# EAGLE design lome6 (EAGLE 5.11)
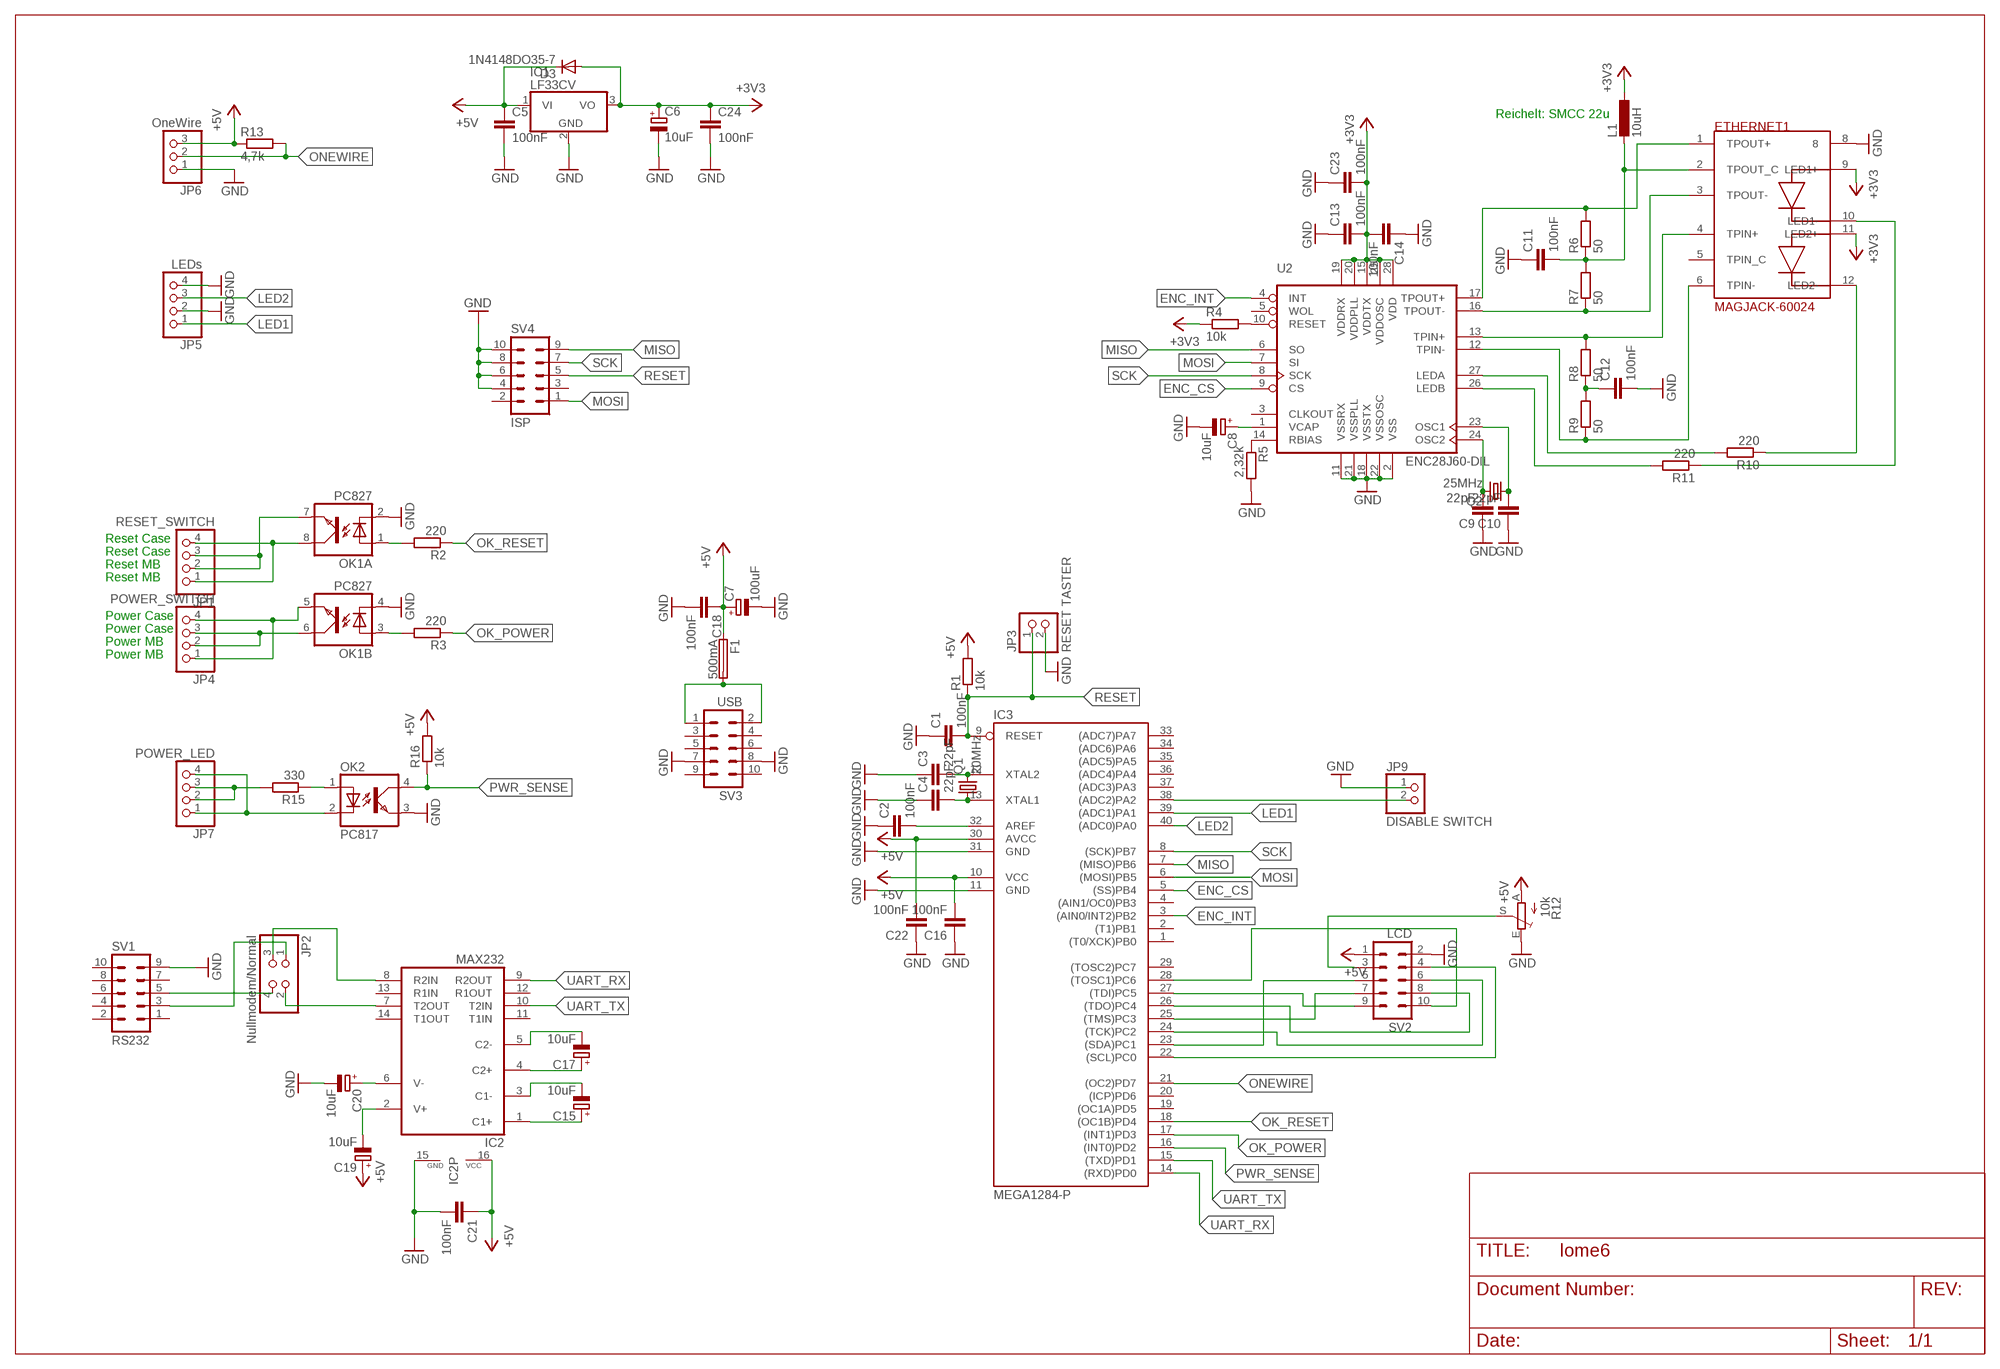
[diagram p0: schematic, sheet 1]

## Parts
C1  100nF  C-EU025-030X050  [C025-030X050]
C2  100nF  C-EU025-030X050  [C025-030X050]
C3  22pF  C-EU025-030X050  [C025-030X050]
C4  22pF  C-EU025-030X050  [C025-030X050]
C5  100nF  C-EU025-030X050  [C025-030X050]
C6  10uF  CPOL-EUE5-6  [E5-6]
C7  100uF  CPOL-EUE5-6  [E5-6]
C8  10uF  CPOL-EUE5-6  [E5-6]
C9  22pF  C-EU025-030X050  [C025-030X050]
C10  22pF  C-EU025-030X050  [C025-030X050]
C11  100nF  C-EU025-030X050  [C025-030X050]
C12  100nF  C-EU025-030X050  [C025-030X050]
C13  100nF  C-EU025-030X050  [C025-030X050]
C14  100nF  C-EU025-030X050  [C025-030X050]
C15  10uF  CPOL-EUE5-6  [E5-6]
C16  100nF  C-EU025-030X050  [C025-030X050]
C17  10uF  CPOL-EUE5-6  [E5-6]
C18  100nF  C-EU025-030X050  [C025-030X050]
C19  10uF  CPOL-EUE5-6  [E5-6]
C20  10uF  CPOL-EUE5-6  [E5-6]
C21  100nF  C-EU025-030X050  [C025-030X050]
C22  100nF  C-EU025-030X050  [C025-030X050]
C23  100nF  C-EU025-030X050  [C025-030X050]
C24  100nF  C-EU025-030X050  [C025-030X050]
D3  1N4148DO35-7  [DO35-7]
ETHERNET1  MAGJACK_60024  [MAGJACK]
F1  500mA  PICOFUSE  [PICOFUSE]
IC1  LF33CV  7805TV  [TO220V]
IC2  MAX232  [DIL16]
IC3  MEGA1284-P  MEGA32-P  [DIL40]
JP1  RESET_SWITCH  PINHD-1X4/90  [1X04/90]
JP2  Nullmodem/Normal  PINHD-2X2  [2X02]
JP3  RESET TASTER  PINHD-1X2  [1X02]
JP4  POWER_SWITCH  PINHD-1X4/90  [1X04/90]
JP5  LEDs  PINHD-1X4  [1X04]
JP6  OneWire  PINHD-1X3  [1X03]
JP7  POWER_LED  PINHD-1X4  [1X04]
JP9  DISABLE SWITCH  PINHD-1X2  [1X02]
L1  10uH  L-EU0207/7  [0207/7]
OK1  PC827  [DIL08]
OK2  PC817  [DIL04]
Q1  20MHz  CRYSTALHC49S  [HC49/S]
Q2  25MHz  CRYSTALHC49S  [HC49/S]
R1  10k  R-EU_0204/5  [0204/5]
R2  220  R-EU_0204/5  [0204/5]
R3  220  R-EU_0204/5  [0204/5]
R4  10k  R-EU_0204/5  [0204/5]
R5  2,32k  R-EU_0204/5  [0204/5]
R6  50  R-EU_0204/2V  [0204V]
R7  50  R-EU_0204/5  [0204/5]
R8  50  R-EU_0204/2V  [0204V]
R9  50  R-EU_0204/5  [0204/5]
R10  220  R-EU_0204/2V  [0204V]
R11  220  R-EU_0204/2V  [0204V]
R12  10k  TRIM_EU-PT10  [PT-10]
R13  4,7k  R-EU_0204/2V  [0204V]
R15  330  R-EU_0204/5  [0204/5]
R16  10k  R-EU_0204/5  [0204/5]
SV1  RS232  ML10  [ML10]
SV2  LCD  ML10  [ML10]
SV3  USB  ML10  [ML10]
SV4  ISP  ML10  [ML10]
U2  ENC28J60-DIL  [DIL28-3]

## Nets
+3V3: C6.+ C13.2 C14.2 C23.2 C24.1 D3.A ETHERNET1.9(LED1+) ETHERNET1.11(LED2+) IC1.3(VO) L1.1 R4.1 U2.15(VDDTX) U2.19(VDDRX) U2.20(VDDPLL) U2.25(VDDOSC) U2.28(VDD)
+5V: C5.1 C7.+ C16.2 C18.1 C19.+ C21.1 C22.2 D3.C F1.1 IC1.1(VI) IC2.16(VCC) IC3.10(VCC) IC3.30(AVCC) JP6.3 R1.2 R12.A R13.1 R16.2 SV2.1
ENC_CS: IC3.5((SS)PB4) U2.9(CS)
ENC_INT: IC3.3((AIN0/INT2)PB2) U2.4(INT)
GND: C1.1 C2.1 C3.1 C4.1 C5.2 C6.- C7.- C8.- C9.1 C10.1 C11.1 C12.2 C13.1 C14.1 C16.1 C18.2 C20.- C21.2 C22.1 C23.1 C24.2 ETHERNET1.8 IC1.2(GND) IC2.15(GND) IC3.11(GND) IC3.31(GND) JP3.2 JP5.2 JP5.4 JP6.1 JP9.1 OK1.2(A:C) OK1.4(B:C) OK2.3(EMIT) R5.2 R12.E SV1.9 SV2.2 SV3.7 SV3.8 SV4.4 SV4.6 SV4.8 SV4.10 U2.2(VSS) U2.11(VSSRX) U2.18(VSSTX) U2.21(VSSPLL) U2.22(VSSOSC)
LED1: IC3.39((ADC1)PA1) JP5.1
LED2: IC3.40((ADC0)PA0) JP5.3
MISO: IC3.7((MISO)PB6) SV4.9 U2.6(SO)
MOSI: IC3.6((MOSI)PB5) SV4.1 U2.7(SI)
N$1: R12.S SV2.3
N$2: C2.2 IC3.32(AREF)
N$3: ETHERNET1.3(TPOUT-) R7.1 U2.16(TPOUT-)
N$4: OK2.1(A) R15.1
N$5: C3.2 IC3.12(XTAL2) Q1.2
N$6: C4.2 IC3.13(XTAL1) Q1.1
N$7: IC2.7(T2OUT) JP2.2
N$8: JP4.1 JP4.4 OK1.5(B:EMIT)
N$9: IC2.8(R2IN) JP2.3
N$10: IC3.38((ADC2)PA2) JP9.2
N$11: ETHERNET1.4(TPIN+) R8.2 U2.13(TPIN+)
N$12: R4.2 U2.10(RESET)
N$13: JP2.1 SV1.3
N$14: R5.1 U2.14(RBIAS)
N$15: C8.+ U2.1(VCAP)
N$16: ETHERNET1.1(TPOUT+) R6.2 U2.17(TPOUT+)
N$17: C10.2 Q2.1 U2.23(OSC1)
N$18: C9.2 Q2.2 U2.24(OSC2)
N$19: ETHERNET1.12(LED2-) R10.1
N$20: ETHERNET1.10(LED1-) R11.1
N$21: ETHERNET1.6(TPIN-) R9.1 U2.12(TPIN-)
N$22: C12.1 R8.1 R9.2
N$23: C11.2 ETHERNET1.2(TPOUT_C) L1.2 R6.1 R7.2
N$24: R10.2 U2.27(LEDA)
N$25: R11.2 U2.26(LEDB)
N$26: JP2.4 SV1.5
N$27: F1.2 SV3.1 SV3.2
N$29: IC3.22((SCL)PC0) SV2.4
N$30: IC3.23((SDA)PC1) SV2.5
N$31: IC3.24((TCK)PC2) SV2.6
N$32: IC3.25((TMS)PC3) SV2.7
N$33: IC3.26((TDO)PC4) SV2.8
N$34: IC3.27((TDI)PC5) SV2.9
N$35: JP7.2 JP7.3 R15.2
N$36: JP7.1 JP7.4 OK2.2(C)
N$37: C19.- IC2.2(V+)
N$38: C20.+ IC2.6(V-)
N$39: C15.+ IC2.1(C1+)
N$40: C15.- IC2.3(C1-)
N$41: JP4.2 JP4.3 OK1.6(B:COL)
N$42: JP1.1 JP1.4 OK1.8(A:COL)
N$47: JP1.2 JP1.3 OK1.7(A:EMIT)
N$49: IC3.28((TOSC1)PC6) SV2.10
N$51: C17.+ IC2.4(C2+)
N$52: C17.- IC2.5(C2-)
N$55: OK1.1(A:A) R2.2
N$56: OK1.3(B:A) R3.2
OK_POWER: IC3.17((INT1)PD3) R3.1
OK_RESET: IC3.18((OC1B)PD4) R2.1
ONEWIRE: IC3.21((OC2)PD7) JP6.2 R13.2
PWR_SENSE: IC3.16((INT0)PD2) OK2.4(COL) R16.1
RESET: C1.2 IC3.9(RESET) JP3.1 R1.1 SV4.5
SCK: IC3.8((SCK)PB7) SV4.7 U2.8(SCK)
UART_RX: IC2.9(R2OUT) IC3.14((RXD)PD0)
UART_TX: IC2.10(T2IN) IC3.15((TXD)PD1)
Unconnected: ETHERNET1.5(TPIN_C) IC2.11(T1IN) IC2.12(R1OUT) IC2.13(R1IN) IC2.14(T1OUT) IC3.1((T0/XCK)PB0) IC3.2((T1)PB1) IC3.4((AIN1/OC0)PB3) IC3.19((OC1A)PD5) IC3.20((ICP)PD6) IC3.29((TOSC2)PC7) IC3.33((ADC7)PA7) IC3.34((ADC6)PA6) IC3.35((ADC5)PA5) IC3.36((ADC4)PA4) IC3.37((ADC3)PA3) SV1.1 SV1.2 SV1.4 SV1.6 SV1.7 SV1.8 SV1.10 SV3.3 SV3.4 SV3.5 SV3.6 SV3.9 SV3.10 SV4.2 SV4.3 U2.3(CLKOUT) U2.5(WOL)

## Notes on the sheet
- Reichelt: SMCC 22u
- Reset Case
- Reset Case
- Reset MB
- Reset MB
- Power Case
- Power Case
- Power MB
- Power MB

## Library data of the parts
C1-C5 C9-C14 C16 C18 C21-C24 = resistor:C-EU: CAPACITOR, European symbol
C6-C8 C15 C17 C19 C20 = resistor:CPOL-EU: POLARIZED CAPACITOR, European symbol
D3 = diode:1N4148: DIODE high speed (Philips)
ETHERNET1 = SparkFun:MAGJACK_60024
F1 = fuse:PICOFUSE: PICOFUSE 19275, Wickmann; OC_FARNELL: unknown; OC_NEWARK: unknown
IC1 = linear:78*: Positive VOLTAGE REGULATOR Source: http://cache.national.com/ds/LM/LM78L05.pdf http://www.fairchildsemi.com/ds/LM/LM7805.pdf
IC2 = maxim:MAX232: RS232 TRANSEIVER
IC3 = atmel:MEGA32-P: MICROCONTROLLER 32 Kbytes FLASH 2 Kbytes SRAM 1 Kbytes EEPROM USART 8-channel 10 bit ADC Source: www.atmel.com .. doc2503.pdf
JP1 JP4 JP5 JP7 = pinhead:PINHD-1X4: PIN HEADER
JP2 = pinhead:PINHD-2X2: PIN HEADER
JP3 JP9 = pinhead:PINHD-1X2: PIN HEADER
JP6 = pinhead:PINHD-1X3: PIN HEADER
L1 = resistor:L-EU: INDUCTOR, European symbol
OK1 = optocoupler:PC827: SHARP OPTO COUPLER; OC_FARNELL: unknown; OC_NEWARK: unknown
OK2 = optocoupler:PC817: SHARP OPTO COUPLER; MPN: PC817X4J000F; OC_FARNELL: 9707727; OC_NEWARK: 97K7059
Q1 Q2 = crystal:CRYSTAL: CRYSTAL
R1-R11 R13 R15 R16 = resistor:R-EU_: RESISTOR, European symbol
R12 = pot:TRIM_EU-: POTENTIOMETER
SV1-SV4 = con-harting-ml:ML10: HARTING; OC_FARNELL: unknown; OC_NEWARK: unknown
U2 = enc28j60:ENC28J60-*: Microchip 10Mbit Ethernet controller with SPI interface Improved SOIC28 layout (pads in 0.01 raster, pin1 slightly smaller). Pin 6 (SO) changed from Out (paralleling several Outs gives an error) to OC. Author: Profi from mikrocontroller.net - forum Date: 2006.0827

## Board
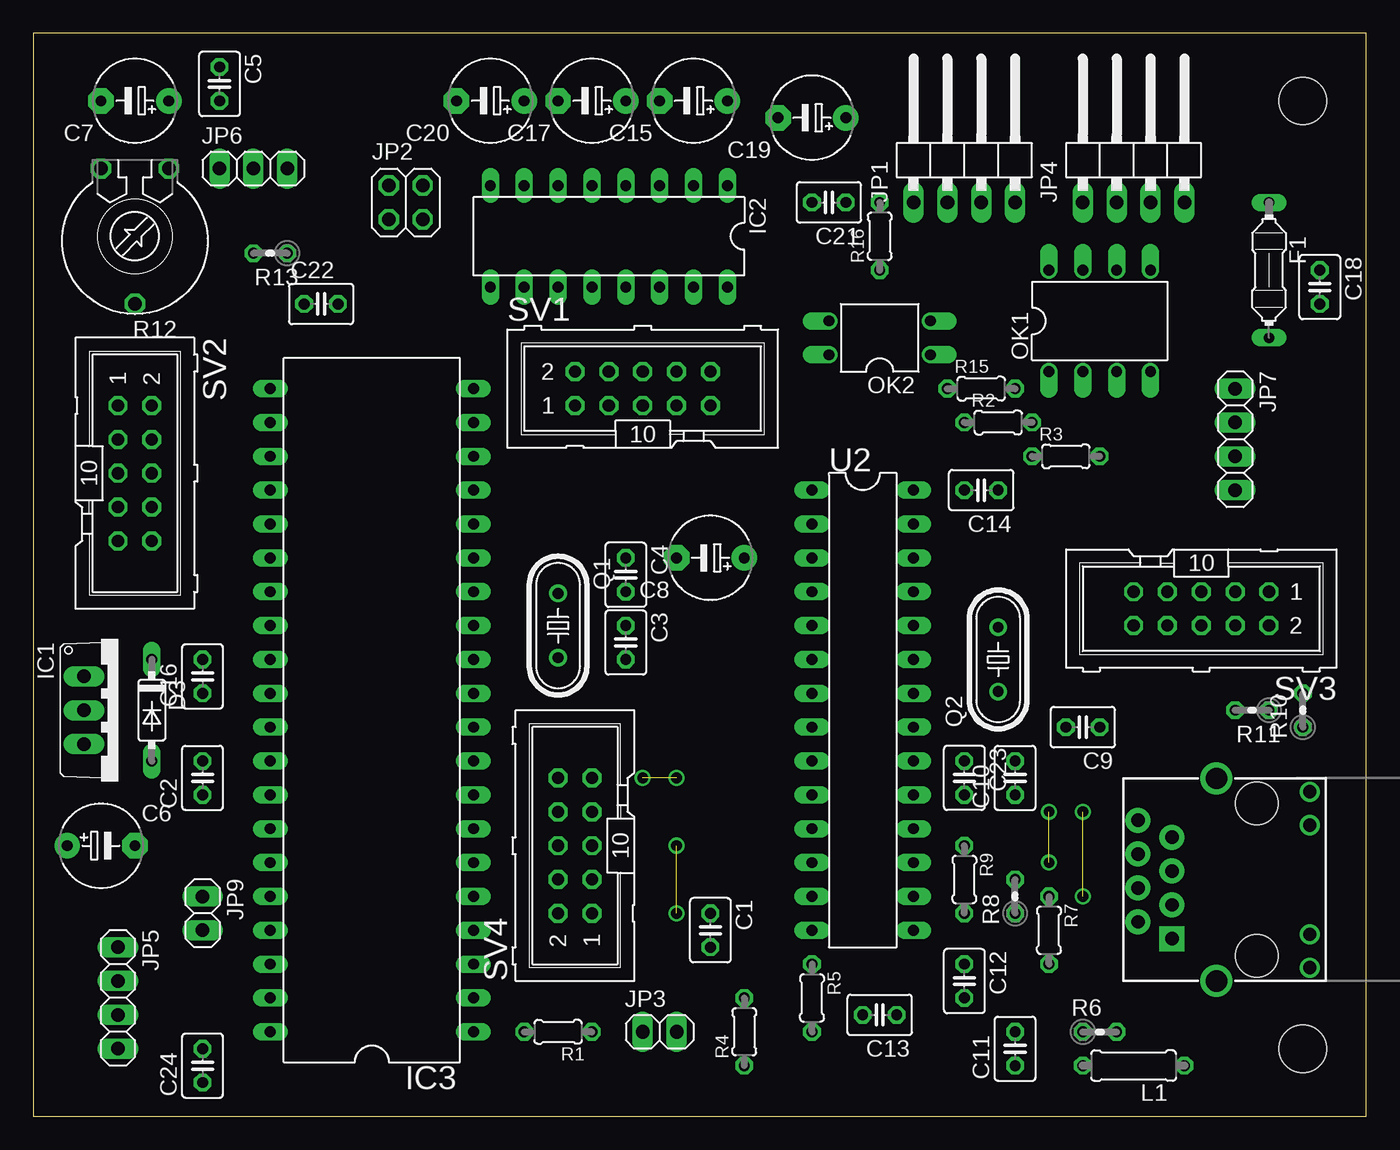
[diagram p1: board, top side]
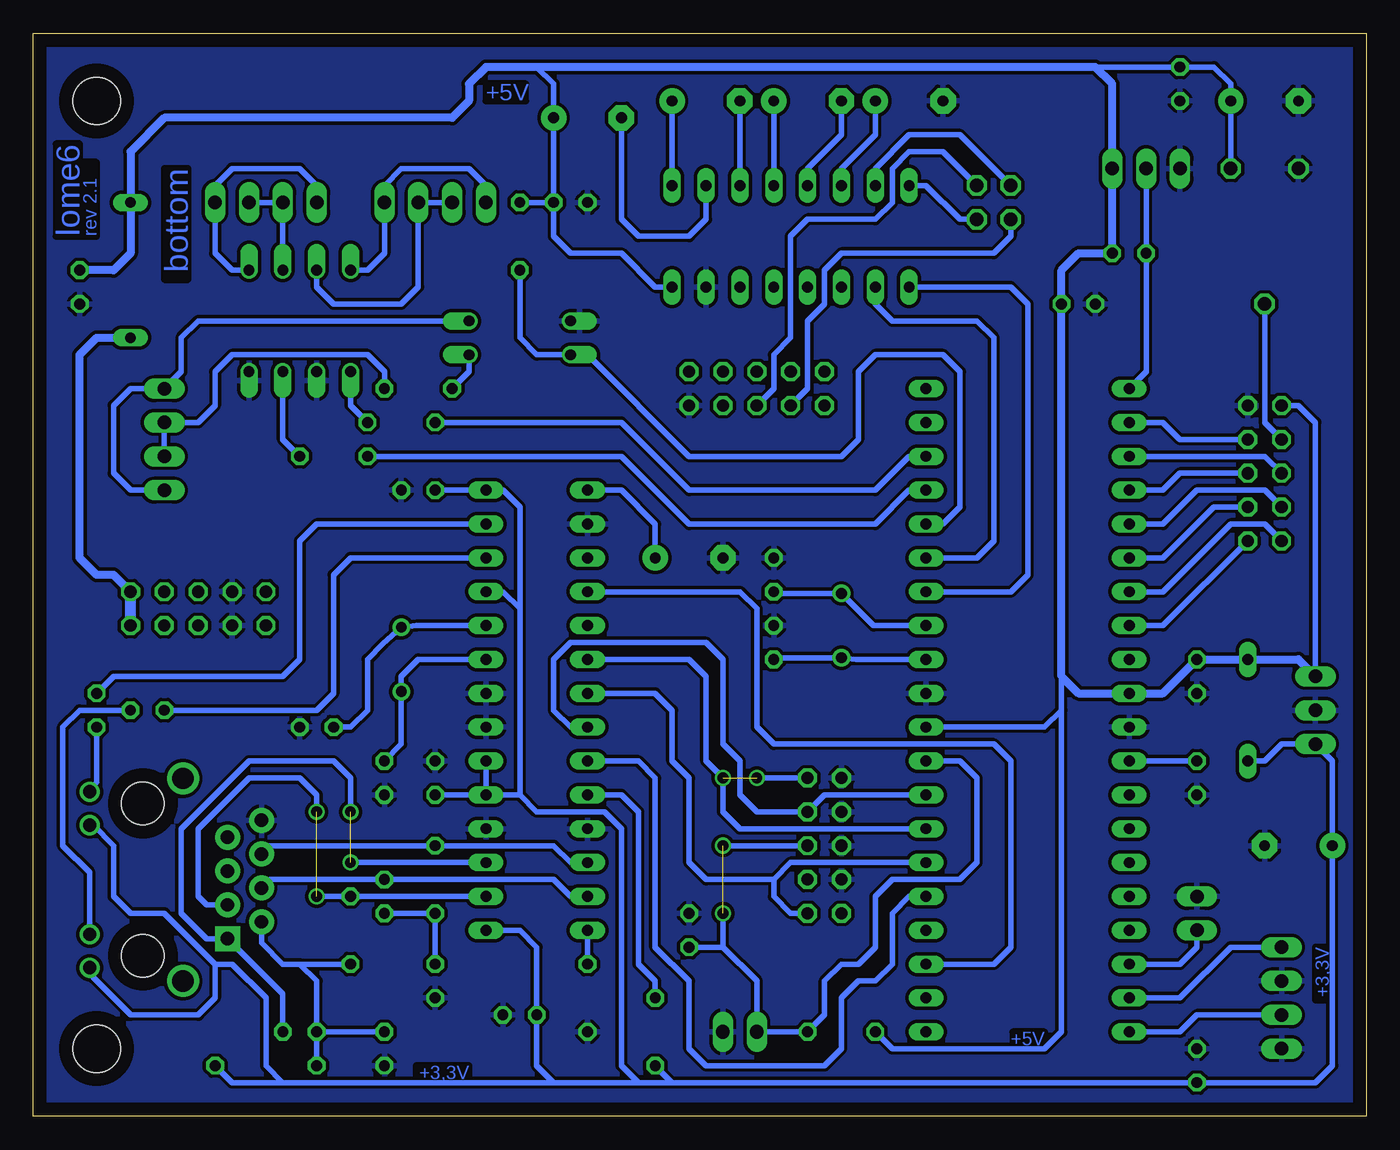
[diagram p2: board, bottom side, seen from below]

Size 100 x 81.27 mm. Coordinates in mm from the lower left corner, seen from the top.
Outline: 0,0 100,0 100,81.27 0,81.27 0,0
Copper layers (1*16): Top 0.035mm / dielectric 1.5mm / Bottom 0.035mm
Design rules "default": minimum track width 10mil, minimum drill 24mil, track to track 8mil, track to pad 8mil, pad to pad 8mil, via to via 8mil, smd to smd 8mil, copper to edge 40mil, drill to drill 8mil, minimum pad ring 10mil, minimum via ring 8mil, stop-mask expansion 4mil, vias tented up to drill 0mil, thermal gap 10mil
Holes 3.56 mm at 95.25,5.08 95.25,76.2

### Footprints (pad centres in the part's own frame; a part is rotated, then mirrored left to right if it is on the bottom)
C025-030X050 = drill 0.813 octagon: 1 -1.27,0; 2 1.27,0
E5-6 = drill 0.813 pad 1.905 round: + -2.54,0 | drill 0.813 pad 1.905 octagon: - 2.54,0
DO35-7 = drill 0.813 long: A 3.81,0; C -3.81,0
MAGJACK = drill 1 pad 1.88 square: 1 3.175,17.445 | drill 1 pad 1.88 round: 2 4.445,19.985; 3 5.715,17.445; 4 6.985,19.985; 5 8.255,17.445; 6 9.525,19.985; 7 10.795,17.445; 8 12.065,19.985 | drill 1 pad 1.27 round: 9 1,7.1; 10 3.5,7.1; 11 11.7,7.1; 12 14.2,7.1 | drill 1.6 pad 2.184 round: M1 0,14.1; M2 15.2,14.1 | hole 3.2: 1.905,11.095; 13.335,11.095
PICOFUSE = drill 0.813 long: 1 -5.08,0; 2 5.08,0
TO220V = drill 1.016 long: 1 -2.54,-2.54; 2 0,-2.54; 3 2.54,-2.54
DIL16 = drill 0.813 long: 1 -8.89,-3.81; 2 -6.35,-3.81; 3 -3.81,-3.81; 4 -1.27,-3.81; 5 1.27,-3.81; 6 3.81,-3.81; 7 6.35,-3.81; 8 8.89,-3.81; 9 8.89,3.81; 10 6.35,3.81; 11 3.81,3.81; 12 1.27,3.81; 13 -1.27,3.81; 14 -3.81,3.81; 15 -6.35,3.81; 16 -8.89,3.81
DIL40 = drill 0.813 long: 1 -24.13,-7.62; 2 -21.59,-7.62; 3 -19.05,-7.62; 4 -16.51,-7.62; 5 -13.97,-7.62; 6 -11.43,-7.62; 7 -8.89,-7.62; 8 -6.35,-7.62; 9 -3.81,-7.62; 10 -1.27,-7.62; 11 1.27,-7.62; 12 3.81,-7.62; 13 6.35,-7.62; 14 8.89,-7.62; 15 11.43,-7.62; 16 13.97,-7.62; 17 16.51,-7.62; 18 19.05,-7.62; 19 21.59,-7.62; 20 24.13,-7.62; 21 24.13,7.62; 22 21.59,7.62; 23 19.05,7.62; 24 16.51,7.62; 25 13.97,7.62; 26 11.43,7.62; 27 8.89,7.62; 28 6.35,7.62; 29 3.81,7.62; 30 1.27,7.62; 31 -1.27,7.62; 32 -3.81,7.62; 33 -6.35,7.62; 34 -8.89,7.62; 35 -11.43,7.62; 36 -13.97,7.62; 37 -16.51,7.62; 38 -19.05,7.62; 39 -21.59,7.62; 40 -24.13,7.62
1X04/90 = drill 1.016 long: 1 -3.81,-3.81; 2 -1.27,-3.81; 3 1.27,-3.81; 4 3.81,-3.81
2X02 = drill 1.016 octagon: 1 -1.27,-1.27; 2 -1.27,1.27; 3 1.27,-1.27; 4 1.27,1.27
1X02 = drill 1.016 long: 1 -1.27,0; 2 1.27,0
1X04 = drill 1.016 long: 1 -3.81,0; 2 -1.27,0; 3 1.27,0; 4 3.81,0
1X03 = drill 1.016 long: 1 -2.54,0; 2 0,0; 3 2.54,0
0207/7 = drill 0.813 octagon: 1 -3.81,0; 2 3.81,0
DIL08 = drill 0.813 offset: 1 -3.81,-3.81; 2 -1.27,-3.81; 3 1.27,-3.81; 4 3.81,-3.81; 5 3.81,3.81; 6 1.27,3.81; 7 -1.27,3.81; 8 -3.81,3.81
DIL04 = drill 0.813 offset: 1 -1.27,-3.81; 2 1.27,-3.81; 3 1.27,3.81; 4 -1.27,3.81
HC49/S = drill 0.813 round: 1 -2.413,0; 2 2.413,0
0204/5 = drill 0.813 octagon: 1 -2.54,0; 2 2.54,0
0204V = drill 0.813 octagon: 1 -1.27,0; 2 1.27,0
PT-10 = drill 1.016 octagon: A -2.54,-5.08; E 2.54,-5.08; S 0,5.08
ML10 = drill 0.914 octagon: 1 -5.08,-1.27; 2 -5.08,1.27; 3 -2.54,-1.27; 4 -2.54,1.27; 5 0,-1.27; 6 0,1.27; 7 2.54,-1.27; 8 2.54,1.27; 9 5.08,-1.27; 10 5.08,1.27
DIL28-3 = drill 0.813 long: 1 -16.51,-3.81; 2 -13.97,-3.81; 3 -11.43,-3.81; 4 -8.89,-3.81; 5 -6.35,-3.81; 6 -3.81,-3.81; 7 -1.27,-3.81; 8 1.27,-3.81; 9 3.81,-3.81; 10 6.35,-3.81; 11 8.89,-3.81; 12 11.43,-3.81; 13 13.97,-3.81; 14 16.51,-3.81; 15 16.51,3.81; 16 13.97,3.81; 17 11.43,3.81; 18 8.89,3.81; 19 6.35,3.81; 20 3.81,3.81; 21 1.27,3.81; 22 -1.27,3.81; 23 -3.81,3.81; 24 -6.35,3.81; 25 -8.89,3.81; 26 -11.43,3.81; 27 -13.97,3.81; 28 -16.51,3.81

### Placement (x,y rotation side)
C1  50.8,13.97 270 top
C2  12.7,25.4 90 top
C3  44.45,35.56 270 top
C4  44.45,40.64 270 top
C5  13.97,77.47 270 top
C6  5.08,20.32 0 top
C7  7.62,76.2 180 top
C8  50.8,41.91 180 top
C9  78.74,29.21 180 top
C10  73.66,25.4 90 top
C11  73.66,5.08 90 top
C12  69.85,10.16 270 top
C13  63.5,7.62 180 top
C14  71.12,46.99 180 top
C15  49.53,76.2 180 top
C16  12.7,33.02 90 top
C17  41.91,76.2 180 top
C18  96.52,62.23 270 top
C19  58.42,74.93 180 top
C20  34.29,76.2 180 top
C21  59.69,68.58 180 top
C22  21.59,60.96 0 top
C23  69.85,25.4 270 top
C24  12.7,3.81 90 top
D3  8.89,30.48 270 top
ETHERNET1  102.87,10.16 90 top
F1  92.71,63.5 270 top
IC1  6.35,30.48 270 top
IC2  43.18,66.04 180 top
IC3  25.4,30.48 90 top
JP1  69.85,72.39 0 top
JP2  27.94,68.58 0 top
JP3  46.99,6.35 0 top
JP4  82.55,72.39 0 top
JP5  6.35,8.89 270 top
JP6  16.51,71.12 0 top
JP7  90.17,50.8 270 top
JP9  12.7,15.24 270 top
L1  82.55,3.81 180 top
OK1  80.01,59.69 0 top
OK2  63.5,58.42 90 top
Q1  39.37,36.83 270 top
Q2  72.39,34.29 90 top
R1  39.37,6.35 180 top
R2  72.39,52.07 0 top
R3  77.47,49.53 0 top
R4  53.34,6.35 90 top
R5  58.42,8.89 270 top
R6  80.01,6.35 0 top
R7  76.2,13.97 270 top
R8  73.66,16.51 90 top
R9  69.85,17.78 270 top
R10  95.25,30.48 90 top
R11  91.44,30.48 180 top
R12  7.62,66.04 180 top
R13  17.78,64.77 180 top
R15  71.12,54.61 0 top
R16  63.5,66.04 90 top
SV1  45.72,54.61 0 top
SV2  7.62,48.26 270 top
SV3  87.63,38.1 180 top
SV4  40.64,20.32 90 top
U2  62.23,30.48 270 top

### Tracks (layer width: path | path; a pad name or v marks a point on that pad's centre or on a via)
+3V3
  Bottom 0.406: U2.15 63.5,13.97 62.23,12.7 C13.2 62.23,3.81 60.96,2.54 | 52.07,2.54 C24.1 3.81,2.54 2.54,3.81 C6.+ 2.54,26.67 IC1.3 6.35,27.94 7.62,26.67 D3.A | 52.07,2.54 54.61,2.54 | 54.61,2.54 60.96,2.54 | 63.5,24.13 63.5,38.1 | 63.5,38.1 63.5,45.72 64.77,46.99 U2.28 C14.2 | 63.5,24.13 62.23,22.86 57.15,22.86 55.88,21.59 55.88,3.81 54.61,2.54 | U2.25 64.77,39.37 63.5,38.1 | 63.5,24.13 U2.19 | 52.07,2.54 R4.1 | U2.19 U2.20 | L1.1 85.09,2.54 81.28,2.54 | 60.96,2.54 81.28,2.54 | ETHERNET1.11 95.52,21.86 93.98,20.32 93.98,16.51 92.71,15.24 90.17,15.24 86.36,11.43 | ETHERNET1.9 95.52,11.16 95.52,10.43 92.71,7.62 87.63,7.62 86.36,8.89 86.36,11.43 | 86.36,11.43 85.09,11.43 82.55,8.89 82.55,3.81 81.28,2.54 | U2.19 C23.2
+5V
  Bottom 0.406: IC3.10 24.13,29.21 22.86,30.48 | 22.86,30.48 22.86,33.02 | IC2.16 53.34,62.23 55.88,64.77 59.69,64.77 60.96,66.04 C21.1 | C21.1 R16.2 | C21.1 C19.+ 60.96,77.47 62.23,78.74 | 20.32,78.74 C5.1 11.43,78.74 10.16,77.47 C7.+ R12.A | SV2.1 5.08,53.34 3.81,52.07 IC1.1 | R1.2 35.56,5.08 24.13,5.08 22.86,6.35 22.86,30.48
  Bottom 0.61: C18.1 93.98,63.5 92.71,64.77 F1.1 92.71,72.39 90.17,74.93 68.58,74.93 67.31,76.2 67.31,77.47 66.04,78.74 62.23,78.74 20.32,78.74 19.05,77.47 JP6.3 R13.1 21.59,64.77 22.86,63.5 C22.2 22.86,33.02 21.59,31.75 IC3.30 15.24,31.75 C16.2 D3.C 5.08,34.29 IC1.1
ENC_CS
  Bottom 0.406: IC3.5 34.29,16.51 35.56,15.24 35.56,11.43 36.83,10.16 38.1,10.16 39.37,8.89 39.37,5.08 40.64,3.81 49.53,3.81 50.8,5.08 50.8,10.16 53.34,12.7 53.34,25.4 54.61,26.67 U2.9
ENC_INT
  Bottom 0.406: U2.4 46.99,39.37 45.72,38.1 45.72,29.21 44.45,27.94 27.94,27.94 26.67,26.67 26.67,12.7 27.94,11.43 IC3.3
GND
  pour Bottom (isolate 0.254): 0,0 100.33,0 100.33,81.28 0,81.28
LED1
  Bottom 0.406: JP5.1 10.16,12.7 13.97,8.89 IC3.39
LED2
  Bottom 0.406: JP5.3 12.7,7.62 13.97,6.35 IC3.40
MISO  (via drill 0.8)  (1 unrouted)
  Bottom 0.406: U2.6 50.8,34.29 49.53,33.02 49.53,26.67 v48.26,25.4 48.26,22.86 46.99,21.59 IC3.7 | SV4.9 v45.72,25.4
MOSI
  Bottom 0.406: U2.7 53.34,31.75 52.07,30.48 52.07,26.67 50.8,25.4 50.8,19.05 49.53,17.78 44.45,17.78 | 44.45,17.78 44.45,16.51 43.18,15.24 SV4.1 | 44.45,17.78 43.18,19.05 IC3.6
N$1
  Bottom 0.406: SV2.3 7.62,52.07 R12.S
N$2
  Bottom 0.406: C2.2 IC3.32
N$3  (via drill 0.8)  (1 unrouted)
  Bottom 0.406: U2.16 R7.1 v78.74,16.51 | ETHERNET1.3 87,15.88 87.63,16.51 87.63,21.59 83.82,25.4 80.01,25.4 78.74,24.13 v78.74,22.86
N$4
  Bottom 0.406: R15.1 67.31,55.88 OK2.1
N$5
  Bottom 0.406: IC3.12 38.23,34.29 Q1.2 44.32,34.42 C3.2
N$6
  Bottom 0.406: IC3.13 36.96,36.83 Q1.1 44.32,39.24 C4.2
N$7
  Bottom 0.406: IC2.7 36.83,71.12 34.29,73.66 30.48,73.66 JP2.2
N$8
  Bottom 0.406: JP4.1 78.74,69.85 80.01,71.12 85.09,71.12 86.36,69.85 JP4.4 86.36,64.77 85.09,63.5 OK1.5
N$9
  Bottom 0.406: JP2.3 30.48,67.31 33.02,69.85 IC2.8
N$10
  Bottom 0.406: IC3.38 13.97,11.43 12.7,12.7 JP9.2
N$11
  Bottom 0.406: U2.13 59.69,16.51 60.96,17.78 R8.2 82.25,17.78 ETHERNET1.4
N$12
  Bottom 0.406: R4.2 53.34,10.16 54.61,11.43 54.61,22.86 55.88,24.13 U2.10
N$13
  Bottom 0.406: JP2.1 26.67,66.04 27.94,64.77 39.37,64.77 40.64,63.5 40.64,60.96 41.91,59.69 41.91,54.61 SV1.3
N$14
  Bottom 0.406: R5.1 U2.14
N$15
  Bottom 0.406: C8.+ 53.34,44.45 55.88,46.99 U2.1
N$16  (via drill 0.8)  (1 unrouted)
  Bottom 0.406: ETHERNET1.1 85.09,13 | U2.17 v76.2,19.05 | ETHERNET1.1 87,13.34 88.9,15.24 88.9,21.59 83.82,26.67 77.47,26.67 76.2,25.4 v76.2,22.86 | R6.2 81.28,9.19 ETHERNET1.1
N$17
  Bottom 0.406: U2.23 71.12,34.29 72.39,33.02 Q2.1 72.39,27.94 C10.2
N$18
  Bottom 0.406: U2.24 71.25,36.83 Q2.2 73.79,35.43 74.93,34.29 74.93,30.48 76.2,29.21 C9.2
N$19
  Bottom 0.406: R10.1 95.25,25.11 ETHERNET1.12
N$20
  Bottom 0.406: R11.1 96.52,30.48 97.79,29.21 97.79,20.32 95.77,18.3 ETHERNET1.10
N$21
  Bottom 0.406: U2.12 59.69,19.05 60.96,20.32 R9.1 82.25,20.32 ETHERNET1.6
N$22
  Bottom 0.406: C12.1 R9.2 R8.1
N$23
  Bottom 0.406: ETHERNET1.2 82.89,13.04 81.28,11.43 80.01,11.43 | 80.01,11.43 R7.2 | C11.2 R6.1 | R6.1 L1.2 | R6.1 78.74,10.16 80.01,11.43
N$24
  Bottom 0.406: R10.2 93.98,33.02 81.28,33.02 80.01,34.29 80.01,43.18 78.74,44.45 U2.27
N$25
  Bottom 0.406: U2.26 76.2,41.91 77.47,40.64 77.47,31.75 78.74,30.48 R11.2
N$26
  Bottom 0.406: JP2.4 31.75,72.39 34.29,72.39 35.56,71.12 35.56,68.58 36.83,67.31 41.91,67.31 43.18,66.04 43.18,58.42 44.45,57.15 44.45,54.61 SV1.5
N$27
  Bottom 0.61: SV3.1 93.98,40.64 95.25,40.64 96.52,41.91 96.52,57.15 95.25,58.42 F1.2
  Bottom 0.813: SV3.2 SV3.1
N$29
  Bottom 0.406: IC3.22 15.24,52.07 13.97,50.8 SV2.4
N$30
  Bottom 0.406: IC3.23 7.62,49.53 SV2.5
N$31
  Bottom 0.406: IC3.24 15.24,46.99 13.97,48.26 SV2.6
N$32
  Bottom 0.406: IC3.25 15.24,44.45 12.7,46.99 7.62,46.99 SV2.7
N$33
  Bottom 0.406: IC3.26 15.24,41.91 11.43,45.72 SV2.8
N$34
  Bottom 0.406: IC3.27 15.24,39.37 10.16,44.45 7.62,44.45 SV2.9
N$35
  Bottom 0.406: JP7.3 JP7.2 87.63,52.07 86.36,53.34 86.36,55.88 85.09,57.15 74.93,57.15 73.66,55.88 R15.2
N$36
  Bottom 0.406: JP7.4 92.71,46.99 93.98,48.26 93.98,53.34 92.71,54.61 JP7.1 88.9,55.88 88.9,58.42 87.63,59.69 OK2.2
N$37
  Bottom 0.406: IC2.2 49.53,67.31 50.8,66.04 54.61,66.04 55.88,67.31 C19.-
N$38
  Bottom 0.406: IC2.6 39.37,71.12 36.83,73.66 C20.+
N$39
  Bottom 0.406: IC2.1 C15.+
N$40
  Bottom 0.406: IC2.3 C15.-
N$41
  Bottom 0.406: JP4.3 JP4.2 OK1.6
N$42
  Bottom 0.406: JP1.1 66.04,69.85 67.31,71.12 72.39,71.12 73.66,69.85 JP1.4 73.66,64.77 74.93,63.5 OK1.8
N$47
  Bottom 0.406: JP1.2 JP1.3 71.12,62.23 72.39,60.96 77.47,60.96 78.74,62.23 OK1.7
N$49
  Bottom 0.406: IC3.28 15.24,36.83 SV2.10
N$51
  Bottom 0.406: IC2.4 C17.+
N$52
  Bottom 0.406: C17.- 39.37,73.66 41.91,71.12 IC2.5
N$55
  Bottom 0.406: R2.2 76.2,53.34 OK1.1
N$56
  Bottom 0.406: OK1.3 81.28,50.8 R3.2
OK_POWER
  Bottom 0.406: IC3.17 34.29,46.99 36.83,44.45 50.8,44.45 55.88,49.53 R3.1
OK_RESET
  Bottom 0.406: IC3.18 34.29,49.53 36.83,46.99 50.8,46.99 55.88,52.07 R2.1
ONEWIRE
  Bottom 0.406: IC3.21 16.51,55.88 R13.2 JP6.2
PWR_SENSE
  Bottom 0.406: R16.1 63.5,58.42 62.23,57.15 OK2.4 58.42,57.15 50.8,49.53 39.37,49.53 38.1,50.8 38.1,55.88 36.83,57.15 31.75,57.15 30.48,55.88 30.48,45.72 31.75,44.45 IC3.16
RESET  (via drill 0.8)  (1 unrouted)
  Bottom 0.406: IC3.9 30.48,26.67 29.21,25.4 29.21,19.05 30.48,17.78 35.56,17.78 36.83,16.51 36.83,12.7 38.1,11.43 39.37,11.43 40.64,10.16 40.64,7.62 R1.1 JP3.1 45.72,10.16 48.26,12.7 | 48.26,12.7 v48.26,15.24 | 48.26,12.7 C1.2 | SV4.5 v48.26,20.32
SCK
  Bottom 0.406: U2.8 59.69,29.21 60.96,30.48 60.96,34.29 59.69,35.56 49.53,35.56 48.26,34.29 48.26,27.94 46.99,26.67 46.99,24.13 45.72,22.86 SV4.7 40.64,24.13 IC3.8
UART_RX
  Bottom 0.406: IC2.9 26.67,62.23 25.4,60.96 25.4,40.64 26.67,39.37 IC3.14
UART_TX
  Bottom 0.406: IC2.10 36.83,60.96 35.56,59.69 29.21,59.69 27.94,58.42 27.94,43.18 29.21,41.91 IC3.15

### Text on the board
Bottom: +5V | bottom | rev 2.1 | lome6 | +3,3V | +5V | +3,3V
Beschriftung: RST.SW. | PWR.SW. | OneWire | + | JP-RS232 | POWERLED | RS232 | LCD | USB | ISP | DIS.SW. | + | LEDs | RSTBTN